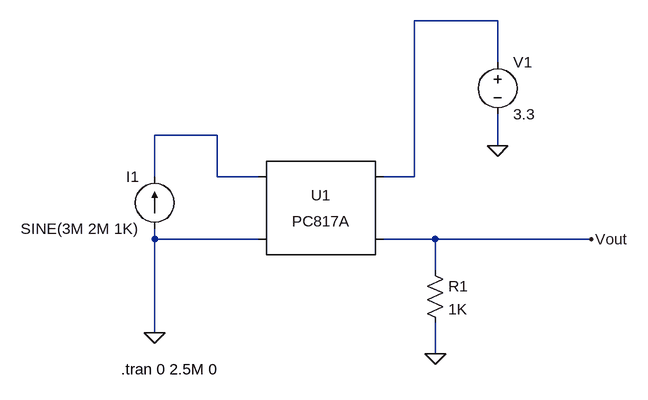
[diagram p0: schematic phototransistor-saturation.asc]
phototransistor-saturation.asc, the LTspice schematic file:
Version 4
SHEET 1 880 680
WIRE 416 -128 288 -128
WIRE 416 -64 416 -128
WIRE -16 48 -112 48
WIRE 416 64 416 16
WIRE -112 112 -112 48
WIRE -16 112 -16 48
WIRE 48 112 -16 112
WIRE 288 112 288 -128
WIRE 288 112 240 112
WIRE -112 208 -112 192
WIRE 48 208 -112 208
WIRE 320 208 240 208
WIRE 560 208 320 208
WIRE 320 256 320 208
WIRE -112 352 -112 208
WIRE 320 384 320 336
FLAG 416 64 0
FLAG 320 384 0
FLAG 560 208 Vout
FLAG -112 352 0
SYMBOL Optos\\PC817A 144 160 R0
SYMATTR InstName U1
SYMBOL res 304 240 R0
SYMATTR InstName R1
SYMATTR Value 1K
SYMBOL voltage 416 -80 R0
WINDOW 123 0 0 Left 0
WINDOW 39 0 0 Left 0
SYMATTR InstName V1
SYMATTR Value 3.3
SYMBOL current -112 192 R180
WINDOW 0 24 80 Left 2
WINDOW 3 24 0 Left 2
WINDOW 123 0 0 Left 0
WINDOW 39 0 0 Left 0
SYMATTR InstName I1
SYMATTR Value SINE(3M 2M 1K)
TEXT -164 408 Left 2 !.tran 0 2.5M 0

The netlist it stands for:
* phototransistor-saturation.asc
XU1 N002 0 N001 Vout PC817 Igain=1m
R1 Vout 0 1K
V1 N001 0 3.3
I1 0 N002 SINE(3M 2M 1K)
.tran 0 2.5M 0
.lib PC817.sub
.backanno
.end